# Altium project Prj_Olymp_ReflowOven_CANNode_STM32.PrjPcb
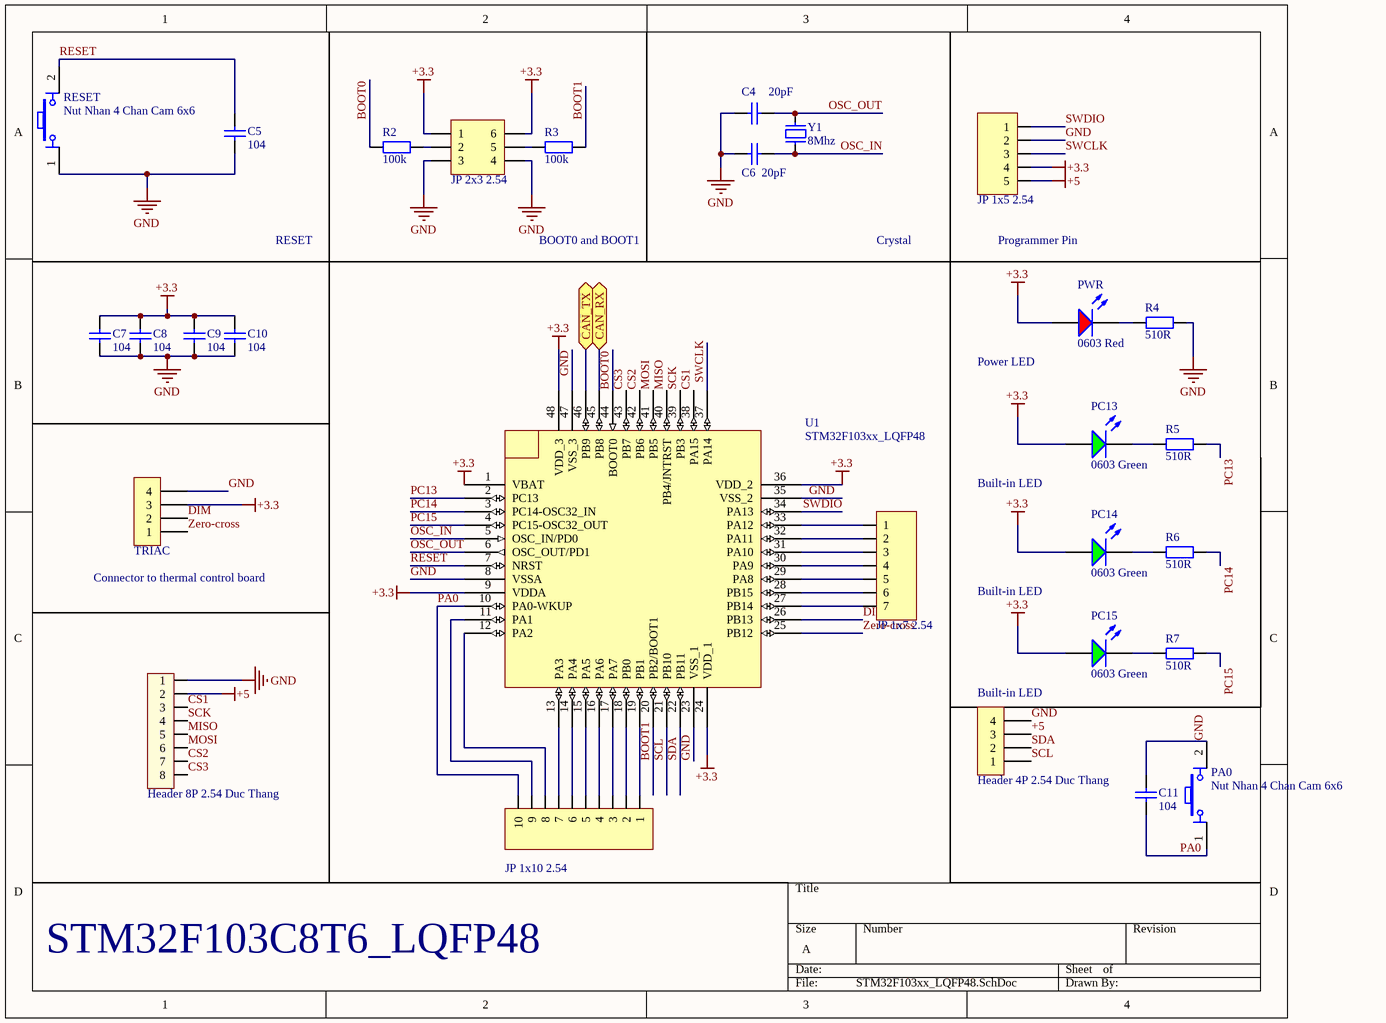
[diagram p0: STM32F103xx_LQFP48.SchDoc]
3 sheets, 38 parts. Net scope: flat (ports and power ports of the same name join across sheets).
Board file: PCB_Olymp_ReflowOven_CANNode_STM32.PcbDoc
Sheets:
  STM32F103xx_LQFP48.SchDoc
  SCH_CAN_Transceiver_TJA1050.SchDoc
  SCH_POWER_5V_to_3.3V.SchDoc

## Sheet STM32F103xx_LQFP48.SchDoc
size A; SheetNumber: 1; SheetTotal: 3

### Parts
C4  20pF  [tu 0603]
C5  104  [tu 0603]
C6  20pF  [tu 0603]
C7  104  [tu 0603]
C8  104  [tu 0603]
C9  104  [tu 0603]
C10  104  [tu 0603]
C11  104  [tu 0603]
H3  TRIAC  [XH2.54M-4]
H4  Header 8P 2.54 Duc Thang  [XH2.54M-8]
H5  Header 4P 2.54 Duc Thang  [XH2.54M-4]
JP2  JP 1x5 2.54  [JP 1x5 DC]
JP3  JP 2x3 2.54  [JP 2x3 DT]
JP4  JP 1x7 2.54  [JP 1x7 DT]
JP5  JP 1x10 2.54  [JP 1x10 DT]
PA0  Nut Nhan 4 Chan Cam 6x6  [Nut Nhan 4 Chan Cam 6x6]
PC13  0603 Green  [0603_LED_S1]
PC14  0603 Green  [0603_LED_S1]
PC15  0603 Green  [0603_LED_S1]
PWR  0603 Red  [0603_LED_S1]
R2  100k  [tro smd 0603]
R3  100k  [tro smd 0603]
R4  510R  [tro smd 0603]
R5  510R  [tro smd 0603]
R6  510R  [tro smd 0603]
R7  510R  [tro smd 0603]
RESET  Nut Nhan 4 Chan Cam 6x6  [Nut Nhan 4 Chan Cam 6x6]
U1  STM32F103xx_LQFP48  [STM32_LQPF48]
Y1  8Mhz  [Thach Anh 2 chan cam]

### Ports
CAN_RX (bidir), CAN_TX (bidir)

### Nets
+3.3: C7.1 C8.1 C9.1 C10.1 H3.3 JP2.4 JP3.1 JP3.6 PC13.A PC14.A PC15.A PWR.A U1.1(VBAT) U1.9(VDDA) U1.24(VDD_1) U1.36(VDD_2) U1.48(VDD_3)
+5: H4.2 H5.3 JP2.5
GND: C4.2 C5.2 C6.2 C7.2 C8.2 C9.2 C10.2 C11.2 H3.4 H4.1 H5.4 JP2.2 JP3.3 JP3.4 PA0.2 R4.1 RESET.1 U1.8(VSSA) U1.23(VSS_1) U1.35(VSS_2) U1.47(VSS_3)
BOOT0: R2.1 U1.44(BOOT0)
BOOT1: R3.2 U1.20(PB2/BOOT1)
CS1: H4.3 U1.38(PA15)
CS2: H4.7 U1.42(PB6)
CS3: H4.8 U1.43(PB7)
DIM: H3.2 U1.26(PB13)
MISO: H4.5 U1.40(PB4/JNTRST)
MOSI: H4.6 U1.41(PB5)
OSC_IN: C6.1 U1.5(OSC_IN/PD0) Y1.1
OSC_OUT: C4.1 U1.6(OSC_OUT/PD1) Y1.2
PA0: C11.1 JP5.10 PA0.1 U1.10(PA0-WKUP)
PC13: R5.1 U1.2(PC13)
PC14: R6.1 U1.3(PC14-OSC32_IN)
PC15: R7.1 U1.4(PC15-OSC32_OUT)
RESET: C5.1 RESET.2 U1.7(NRST)
SCK: H4.4 U1.39(PB3)
SCL: H5.1 U1.21(PB10)
SDA: H5.2 U1.22(PB11)
SWCLK: JP2.3 U1.37(PA14)
SWDIO: JP2.1 U1.34(PA13)
Zero-cross: H3.1 U1.25(PB12)
NetIC1_1: U1.46(PB9) ; port CAN_TX
NetIC1_4: U1.45(PB8) ; port CAN_RX
NetJP3_2: JP3.2 R2.2
NetJP3_5: JP3.5 R3.1
NetJP4_1: JP4.1 U1.33(PA12)
NetJP4_2: JP4.2 U1.32(PA11)
NetJP4_3: JP4.3 U1.31(PA10)
NetJP4_4: JP4.4 U1.30(PA9)
NetJP4_5: JP4.5 U1.29(PA8)
NetJP4_6: JP4.6 U1.28(PB15)
NetJP4_7: JP4.7 U1.27(PB14)
NetJP5_1: JP5.1 U1.19(PB1)
NetJP5_2: JP5.2 U1.18(PB0)
NetJP5_3: JP5.3 U1.17(PA7)
NetJP5_4: JP5.4 U1.16(PA6)
NetJP5_5: JP5.5 U1.15(PA5)
NetJP5_6: JP5.6 U1.14(PA4)
NetJP5_7: JP5.7 U1.13(PA3)
NetJP5_8: JP5.8 U1.12(PA2)
NetJP5_9: JP5.9 U1.11(PA1)
NetPC13_K: PC13.K R5.2
NetPC14_K: PC14.K R6.2
NetPC15_K: PC15.K R7.2
NetPWR_K: PWR.K R4.2

### Notes on the sheet
- RESET
- BOOT0 and BOOT1
- Crystal
- Programmer Pin
- Power LED
- Built-in LED
- (near H3) Connector to thermal control board
- (near H5) Built-in LED
- STM32F103C8T6_LQFP48

### Library data of the parts
C4 C6 = Tu 0603 22pF 50V 10%: Dán; Don_Vi: Con; So_Chan: 2; Ten_Linh_Kien: Tụ 0603 22pF 50V 10%; Ma_Hang: MH004570; Chung_Loai: Dán; Kieu_Chan: *
C5 C7-C11 = Tu 0603 104 50V 10%: Dán; Don_Vi: Con; So_Chan: 2; Ten_Linh_Kien: Tụ 0603 104-100nF 10% 50V; Ma_Hang: MH004568; Chung_Loai: Dán; Kieu_Chan: *
H3 H5 = Header 4P 2.54 Duc Thang: Cắm; Ten_Linh_Kien: Header 4P XH2.54-4P Đực Thẳng; Don_Vi: Con; Ma_Hang: MH001285; Chung_Loai: Cắm
H4 = Header 8P 2.54 Duc Thang: Cắm; Ten_Linh_Kien: Header 8P XH2.54-8P Đực Thẳng; Don_Vi: Con; Ma_Hang: MH003366; Chung_Loai: Cắm
JP2 = JP 1x5 2.54 Duc Cong: Cắm; Ten_Linh_Kien: Jump Đơn Đực 2.54MM 1x40P Cong Đứng; Don_Vi: Con; Ma_Hang: MH000904; Ghi_Chu: *; Kieu_Chan: *; Chung_Loai: Cắm
JP3 = JP 2x3 2.54 Duc Thang: Cắm; Ten_Linh_Kien: Jump Đôi Đực 2.54MM 2x40P Thẳng 11MM; Don_Vi: Con; Ma_Hang: MH002686; Ghi_Chu: *; Kieu_Chan: *; Chung_Loai: Cắm
JP4 = JP 1x7 2.54 Duc Thang: Cắm; Ten_Linh_Kien: Jump Đơn Đực 2.54MM 1x40P Thẳng 11MM; Don_Vi: Con; Ma_Hang: MH000903; Ghi_Chu: *; Kieu_Chan: *; Chung_Loai: Cắm
JP5 = JP 1x10 2.54 Duc Thang: Cắm; Ten_Linh_Kien: Jump Đơn Đực 2.54MM 1x40P Thẳng 11MM; Don_Vi: Con; Ma_Hang: MH000903; Ghi_Chu: *; Kieu_Chan: *; Chung_Loai: Cắm
PA0 RESET = Nut Nhan 4 Chan Cam 6x6: Nut Nhan 4 Chan 6x6mm; Ten: Nút Nhấn 4 Chân 6x6x5MM DIP; Ma_Hang: MH004584
PC13-PC15 = 0603 LED Green: LED; ComponentLink1Description: 供应商链接; ComponentLink1URL: http://www.szlcsc.com/product/details_73152.html; Package: 0603; Supplier: LC; SuppliersPartNumber: C72043; Color: Green
PWR = 0603 LED Red: LED; ComponentLink1Description: 供应商链接; ComponentLink1URL: http://www.szlcsc.com/product/details_2659.html; Package: 0603; Supplier: LC; SuppliersPartNumber: C2286; Color: Red
R2-R7 = Tro 0603 1% 10k: Dán; Don_Vi: Con; So_Chan: 2; Ten_Linh_Kien: Trở 0603 1% 10k; Ma_Hang: MH006333; Chung_Loai: Dán; Kieu_Chan: *
Y1 = Thach Anh 2 chan Cam: Crystal For all Crystal 2pin.; Value: 4Mhz
U1 = STM32F103xx_LQFP48: Published: 30-May-2008; DatasheetVersion: rev6, Mar-2008; PackageVersion: Mar-2008; PackageReference: LQFP48; Publisher: Altium Limited; PackageDescription: 48-Pin Low-Profile Quad Flat Pack, 7 x 7 mm Body, 0.5 mm Pitch (LQFP48); ComponentLink1Description: Manufacturer Link; ComponentLink1URL: www.st.com/stm32; ComponentLink2Description: Datasheet; ComponentLink2URL: http://www.st.com/stonline/products/literature/ds/13587.pdf

## Sheet SCH_CAN_Transceiver_TJA1050.SchDoc
size A; SheetNumber: 2; SheetTotal: 3
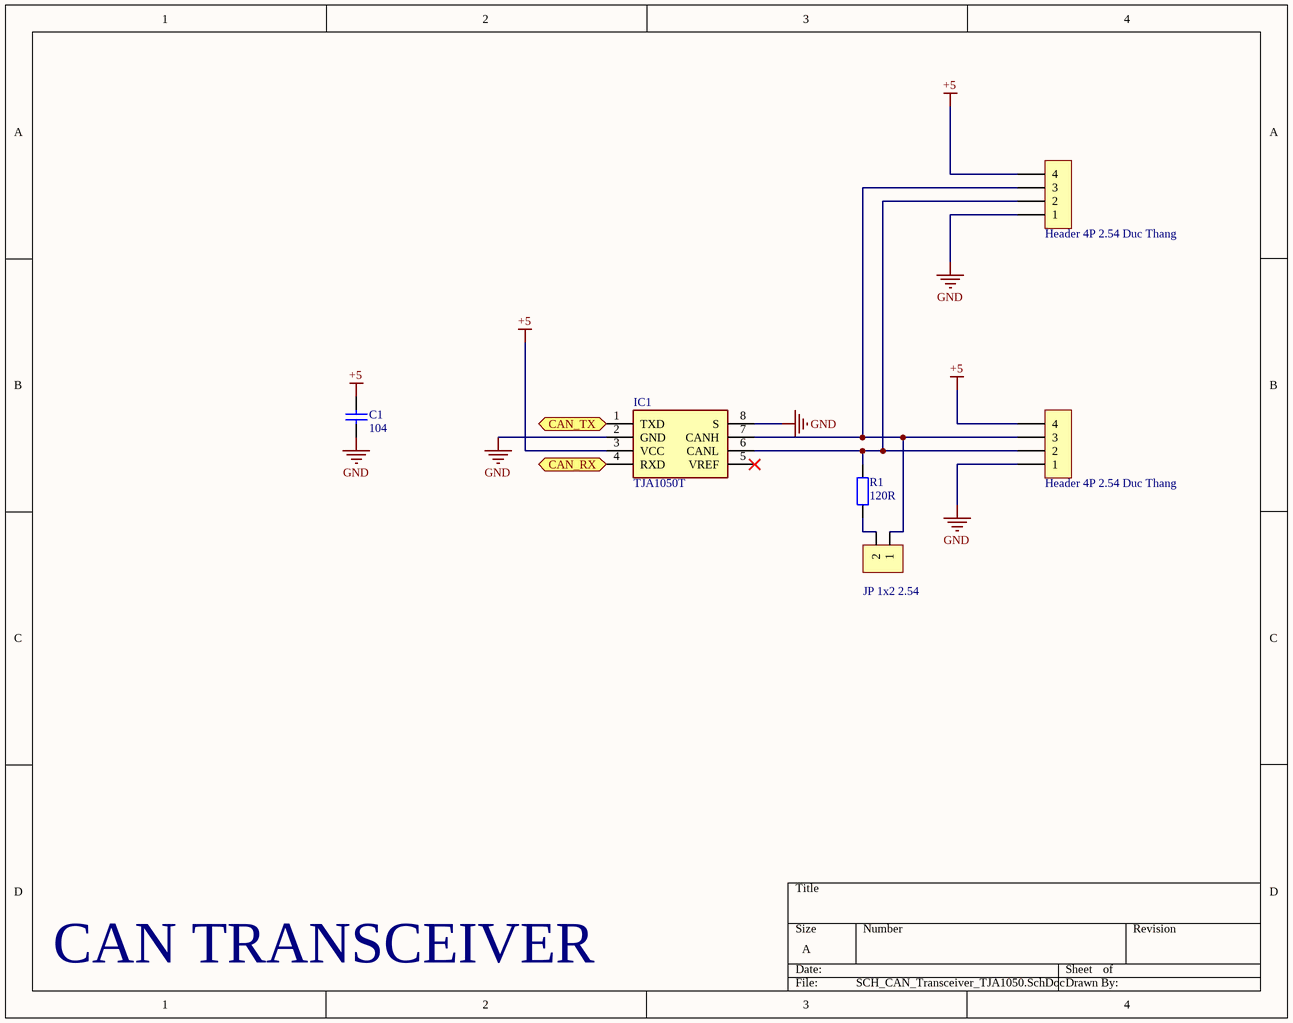
[diagram p1: SCH_CAN_Transceiver_TJA1050.SchDoc]

### Parts
C1  104  [tu 0603]
H1  Header 4P 2.54 Duc Thang  [XH2.54M-4]
H2  Header 4P 2.54 Duc Thang  [XH2.54M-4]
IC1  TJA1050T  [SOIC127P600X175-8N]
JP1  JP 1x2 2.54  [JP 1x2 DT]
R1  120R  [tro smd 0603]

### Ports
CAN_RX (bidir), CAN_TX (bidir)

### Nets
+5: C1.1 H1.4 H2.4 IC1.3(VCC)
GND: C1.2 H1.1 H2.1 IC1.2(GND) IC1.8(S)
NetH1_2: H1.2 H2.2 IC1.6(CANL) R1.2
NetH1_3: H1.3 H2.3 IC1.7(CANH) JP1.1
NetIC1_1: IC1.1(TXD) ; port CAN_TX
NetIC1_4: IC1.4(RXD) ; port CAN_RX
NetJP1_2: JP1.2 R1.1

Not connected (* = marked no-connect by the designer): IC1 5(VREF)*

### Notes on the sheet
- CAN TRANSCEIVER

### Library data of the parts
C1 = Tu 0603 104 50V 10%: as C5 on sheet STM32F103xx_LQFP48; Chung_Loai: Dán; Kieu_Chan: *
H1 H2 = Header 4P 2.54 Duc Thang: as H3 on sheet STM32F103xx_LQFP48; Chung_Loai: Cắm
IC1 = TJA1050T: Integrated Circuit; Manufacturer_Name: NXP; Datasheet Link: https://datasheet.datasheetarchive.com/originals/distributors/Datasheets-NXP/DSANXP010005907.pdf; Height: 1.75mm; Manufacturer_Part_Number: TJA1050T; Mouser Part Number: N/A; Mouser Price/Stock: https://www.mouser.co.uk/ProductDetail/NXP-Semiconductors/TJA1050T?qs=WhRErS6oET%252B5mtiFrt9ZMQ%3D%3D
JP1 = JP 1x2 2.54 Duc Thang: Cắm; Ten_Linh_Kien: Jump Đơn Đực 2.54MM 1x40P Thẳng 11MM; Don_Vi: Con; Ma_Hang: MH000903; Ghi_Chu: *; Kieu_Chan: *; Chung_Loai: Cắm
R1 = Tro 0603 1% 0R: Dán; Don_Vi: Con; So_Chan: 2; Ten_Linh_Kien: Trở 0603 1% 0R; Ma_Hang: MH005792; Chung_Loai: Dán; Kieu_Chan: *

## Sheet SCH_POWER_5V_to_3.3V.SchDoc
size A; SheetNumber: 3; SheetTotal: 3
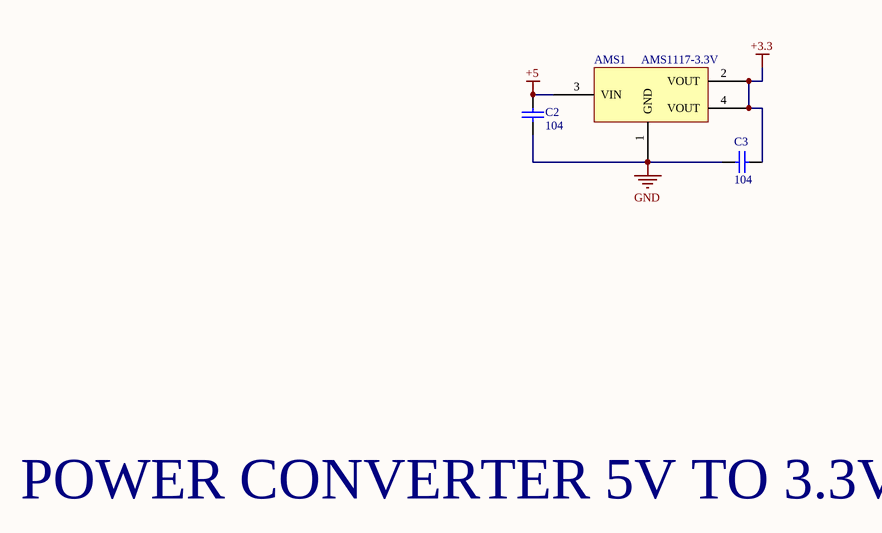
[diagram p2: SCH_POWER_5V_to_3.3V.SchDoc]

### Parts
AMS1  AMS1117-3.3V  [SOT223]
C2  104  [tu 0603]
C3  104  [tu 0603]

### Nets
+3.3: AMS1.2(VOUT) AMS1.4(VOUT) C3.2
+5: AMS1.3(VIN) C2.2
GND: AMS1.1(GND) C2.1 C3.1

### Notes on the sheet
- POWER CONVERTER 5V TO 3.3V

### Library data of the parts
AMS1 = AMS1117 SMD: Dán; Value: AMS1117-3.3V SOT223; Don_Vi: Con; Ma_Hang: MH000596; Ghi_Chu: *; Kieu_Chan: *; Chung_Loai: Dán
C2 C3 = Tu 0603 106 16V 20%: Dán; Don_Vi: Con; So_Chan: 2; Ten_Linh_Kien: Tụ 0603-10uF 20% 16V; Ma_Hang: MH004848; Chung_Loai: Dán; Kieu_Chan: *

## Nets that join several sheets
+3.3: STM32F103xx_LQFP48 (17 pins), SCH_POWER_5V_to_3.3V (AMS1.2 AMS1.4 C3.2)
+5: STM32F103xx_LQFP48 (H4.2 H5.3 JP2.5), SCH_CAN_Transceiver_TJA1050 (C1.1 H1.4 H2.4 IC1.3), SCH_POWER_5V_to_3.3V (AMS1.3 C2.2)
GND: STM32F103xx_LQFP48 (21 pins), SCH_CAN_Transceiver_TJA1050 (5 pins), SCH_POWER_5V_to_3.3V (AMS1.1 C2.1 C3.1)
NetIC1_1: STM32F103xx_LQFP48 (U1.46), SCH_CAN_Transceiver_TJA1050 (IC1.1)
NetIC1_4: STM32F103xx_LQFP48 (U1.45), SCH_CAN_Transceiver_TJA1050 (IC1.4)